# Altium schematic sheet Ethnet.SchDoc
size A4
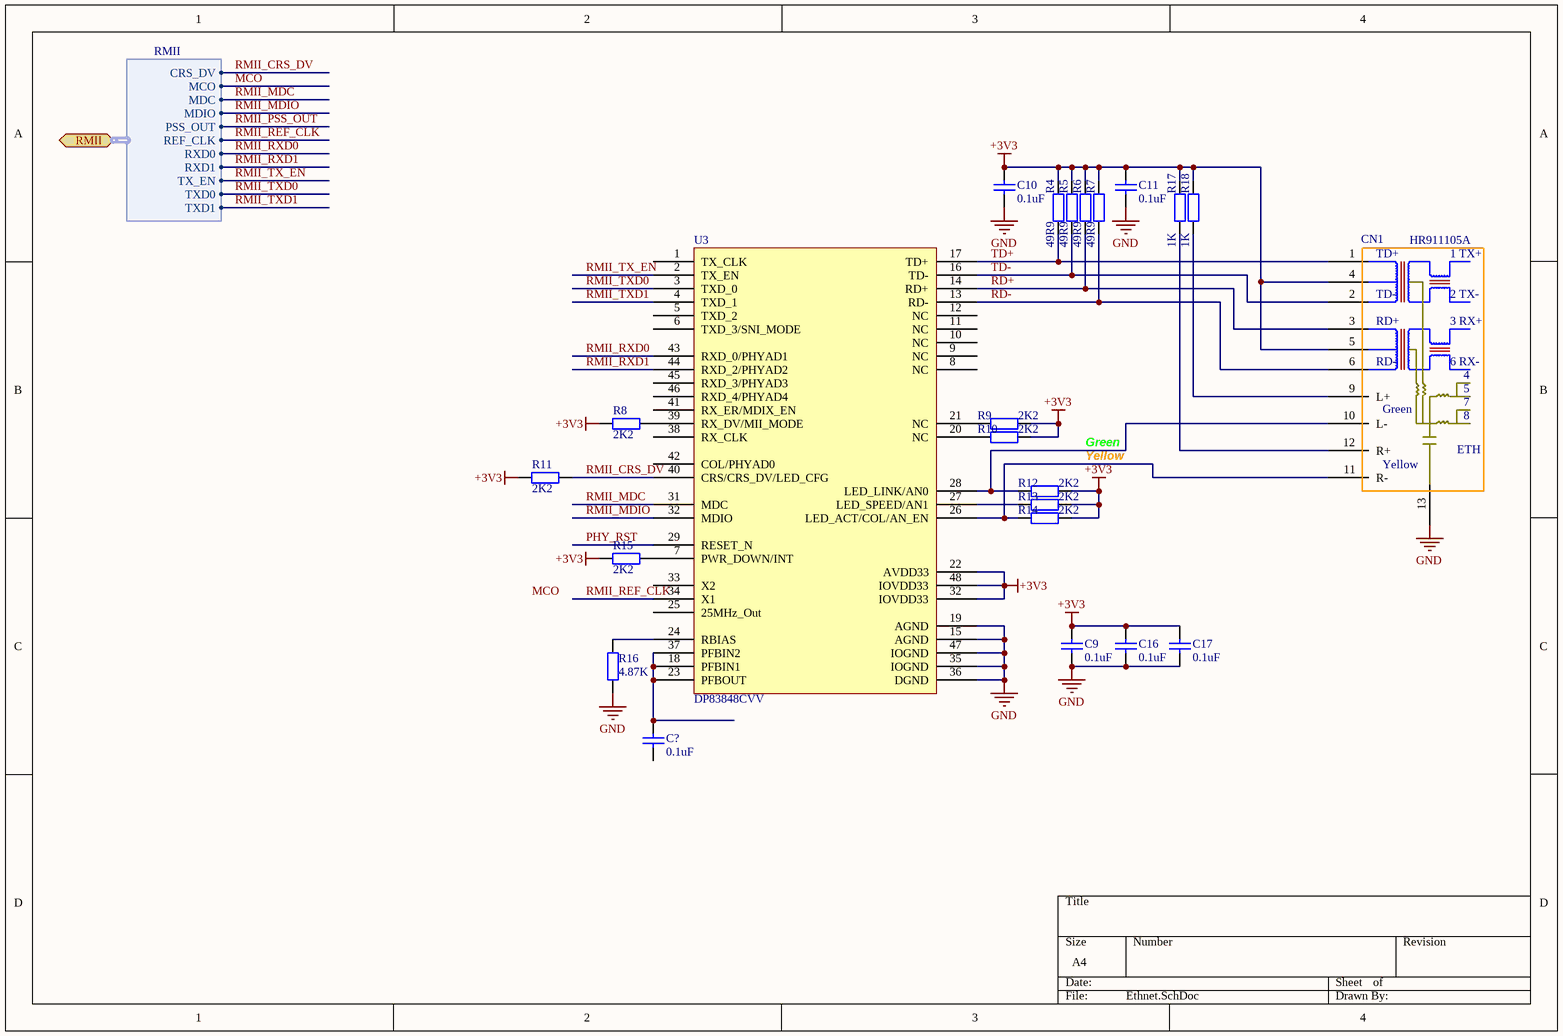
[diagram p0: Ethnet.SchDoc]

## Parts
C9  0.1uF  [C0805]
C10  0.1uF  [C0805]
C11  0.1uF  [C0805]
C16  0.1uF  [C0805]
C17  0.1uF  [C0805]
C?  0.1uF  [C0805]
CN1  HR911105A  [HR911105A]
R4  49R9  [0805]
R5  49R9  [0805]
R6  49R9  [0805]
R7  49R9  [0805]
R8  2K2  [0805]
R9  2K2  [0805]
R10  2K2  [0805]
R11  2K2  [0805]
R12  2K2  [0805]
R13  2K2  [0805]
R14  2K2  [0805]
R15  2K2  [0805]
R16  4.87K  [0805]
R17  1K  [0805]
R18  1K  [0805]
U3  DP83848CVV  [LQFP48]

## Ports
RMII (harness RMII)

## Harnesses
RMII: CRS_DV, MCO, MDC, MDIO, PSS_OUT, REF_CLK, RXD0, RXD1, TX_EN, TXD0, TXD1

## Nets
+3V3: C9.2 C10.2 C11.2 C16.2 C17.2 CN1.4 CN1.5 R4.2 R5.2 R6.2 R7.2 R8.1 R9.2 R10.2 R11.1 R12.2 R13.2 R14.2 R15.1 R17.2 R18.2 U3.22(AVDD33) U3.32(IOVDD33) U3.48(IOVDD33)
GND: C9.1 C10.1 C11.1 C16.1 C17.1 CN1.13 R16.2 U3.15(AGND) U3.19(AGND) U3.35(IOGND) U3.36(DGND) U3.47(IOGND)
MCO: port RMII.MCO
PHY_RST: U3.29(RESET_N)
RD+: CN1.3 R6.1 U3.14(RD+)
RD-: CN1.6 R7.1 U3.13(RD-)
RMII_CRS_DV: R11.2 U3.40(CRS/CRS_DV/LED_CFG) ; port RMII.CRS_DV
RMII_MDC: U3.31(MDC) ; port RMII.MDC
RMII_MDIO: U3.32(MDIO) ; port RMII.MDIO
RMII_PSS_OUT: port RMII.PSS_OUT
RMII_REF_CLK: U3.34(X1) ; port RMII.REF_CLK
RMII_RXD0: U3.43(RXD_0/PHYAD1) ; port RMII.RXD0
RMII_RXD1: U3.44(RXD_2/PHYAD2) ; port RMII.RXD1
RMII_TX_EN: U3.2(TX_EN) ; port RMII.TX_EN
RMII_TXD0: U3.3(TXD_0) ; port RMII.TXD0
RMII_TXD1: U3.4(TXD_1) ; port RMII.TXD1
TD+: CN1.1 R4.1 U3.17(TD+)
TD-: CN1.2 R5.1 U3.16(TD-)
NetC?_2: C?.2 U3.18(PFBIN1) U3.23(PFBOUT) U3.37(PFBIN2)
NetCN1_9: CN1.9(L+) R18.1
NetCN1_10: CN1.10(L-) R12.1 U3.28(LED_LINK/AN0)
NetCN1_11: CN1.11(R-) R14.1 U3.26(LED_ACT/COL/AN_EN)
NetCN1_12: CN1.12(R+) R17.1
NetR8_2: R8.2 U3.39(RX_DV/MII_MODE)
NetR9_1: R9.1 U3.21(NC)
NetR10_1: R10.1 U3.20(NC)
NetR13_1: R13.1 U3.27(LED_SPEED/AN1)
NetR15_2: R15.2 U3.7(PWR_DOWN/INT)
NetR16_1: R16.1 U3.24(RBIAS)

Not connected (* = marked no-connect by the designer): C? 1; U3 1(TX_CLK) 5(TXD_2) 6(TXD_3/SNI_MODE) 8(NC) 9(NC) 10(NC) 11(NC) 12(NC) 25(25MHz_Out) 33(X2) 38(RX_CLK) 41(RX_ER/MDIX_EN) 42(COL/PHYAD0) 45(RXD_3/PHYAD3) 46(RXD_4/PHYAD4)

## Notes on the sheet
- Green
- Yellow
- Labels drawn without touching a wire or pin: MCO
- (in symbol HR911105A) TD+; 1 TX+; TD-; 2 TX-; RD+; 3 RX+; RD-; 6 RX-; 7; Green; 8; ETH; Yellow

## Library data of the parts
C9-C11 C16 C17 C? = Cap: 0805贴片电容
R4-R18 = Res2: 0805贴片电阻
U3 = DP83848